# Altium schematic sheet MainBoard_V100_ON_OFF.SchDoc
size A4; SheetNumber: 15; SheetTotal: 22; Title_: On Off Controller
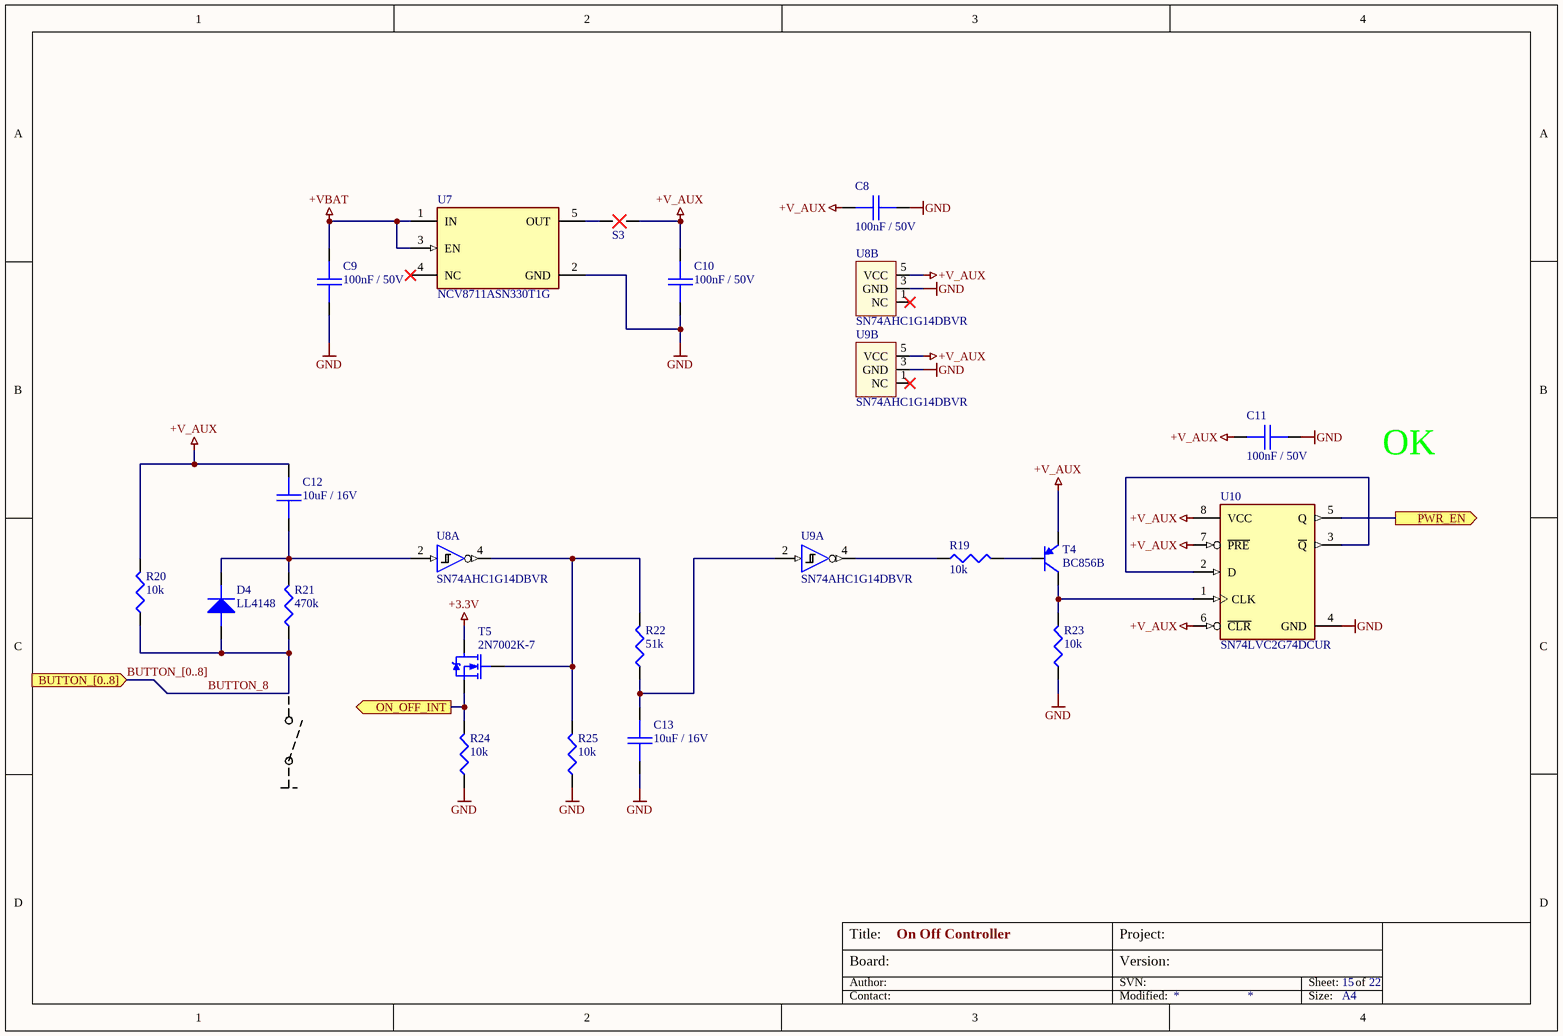
[diagram p0: MainBoard_V100_ON_OFF.SchDoc]

## Parts
C8  100nF / 50V  [0805_C]
C9  100nF / 50V  [0805_C]
C10  100nF / 50V  [0805_C]
C11  100nF / 50V  [0805_C]
C12  10uF / 16V  [0805_C]
C13  10uF / 16V  [0805_C]
D4  LL4148  [SOD80]
R19  10k  [0805]
R20  10k  [0805]
R21  470k  [0805]
R22  51k  [0805]
R23  10k  [0805]
R24  10k  [0805]
R25  10k  [0805]
S3  SPLITER  [SPLITER2_30mil_9mil]  (value not drawn)  (no BOM)
T4  BC856B  [SOT-23]
T5  2N7002K-7  [SOT-23]
U7  NCV8711ASN330T1G  [TSOP-5]
U8  SN74AHC1G14DBVR  [SOT-23-5]  (parts A,B of 2)
U9  SN74AHC1G14DBVR  [SOT-23-5]  (parts A,B of 2)
U10  SN74LVC2G74DCUR  [VSSOP-8_DCU]

## Ports
BUTTON_[0..8] (in), ON_OFF_INT (out), PWR_EN (out)

## Nets
+3.3V: T5.3(D)
+V_AUX: C8.1 C10.2 C11.1 C12.1 R20.2 S3.2 T4.2(E) U8.5(VCC) U9.5(VCC) U10.6(~{CLR}) U10.7(~{PRE}) U10.8(VCC)
+VBAT: C9.2 U7.1(IN) U7.3(EN)
GND: C8.2 C9.1 C10.1 C11.2 C13.2 R23.1 R24.1 R25.1 U7.2(GND) U8.3(GND) U9.3(GND) U10.4(GND)
BUTTON_8: D4.A R20.1 R21.1
ON_OFF_INT: R24.2 T5.2(S) ; port ON_OFF_INT
PWR_EN: U10.5(Q) ; port PWR_EN
NetC12_2: C12.2 D4.K R21.2 U8.2(A)
NetC13_1: C13.1 R22.1 U9.2(A)
NetR19_1: R19.1 U9.4(Y)
NetR19_2: R19.2 T4.1(B)
NetR22_2: R22.2 R25.2 T5.1(G) U8.4(Y)
NetR23_2: R23.2 T4.3(C) U10.1(CLK)
NetS3_1: S3.1 U7.5(OUT)
NetU10_2: U10.2(D) U10.3(~{Q})

Not connected (* = marked no-connect by the designer): U7 4(NC)*; U8 1(NC)*; U9 1(NC)*

## Buses and harness runs
bus BUTTON_[0..8] = port BUTTON_[0..8]

## Notes on the sheet
- OK
- Board:
- Author:
- Title:
- Project:
- SVN:
- Version:
- Sheet:
- of
- Contact:
- Modified:
- Size:
- A4

## Library data of the parts
C8-C11 = 149: 100nF 50V X7R; Part Number: SMD0805-100nF-50V; Azonosító: 149; Category: Passives; Subcategory: PASS_Capacitor; Supplier 1: HESTORE; Supplier 1 order number: 100.011.22
C12 C13 = 153: 10uF 16V X5R; Part Number: SMD0805-10uF-16V; Azonosító: 153; Category: Passives; Subcategory: PASS_Capacitor; Supplier 1: HESTORE; Supplier 1 order number: 100.344.52
D4 = 372: General Purpose, Power, Switching Small Signal Diode, SOD-80, 100V, 0.15A, 175C; Azonosító: 372; Part Number: LL4148; Category: Semiconductors; Subcategory: SEMI_Diode; Supplier 1: MOUSER; Supplier 1 order number: 637-LL4148; Supplier 2: HESTORE; Supplier 2 order number: 100.230.69; Help URL: https://diotec.com/request/datasheet/ll4148.pdf
R19 R20 R23-R25 = 59: 10k 0805 0.125W 1%; Part Number: SMD0805-10k 1%; Azonosító: 59; Category: Passives; Subcategory: PASS_Resistor; Supplier 1: HESTORE; Supplier 1 order number: 100.403.38
R21 = 69: 470k 0805 0.125W 1%; Part Number: SMD0805-470k 1%; Azonosító: 69; Category: Passives; Subcategory: PASS_Resistor; Supplier 1: HESTORE; Supplier 1 order number: 100.011.79
R22 = 64: 51k 0805 0.125W 5%; Part Number: SMD0805-51k 5%; Azonosító: 64; Category: Passives; Subcategory: PASS_Resistor; Supplier 1: HESTORE; Supplier 1 order number: 100.201.72
S3 = 272: SPLITER2_30mil_9mil; Azonosító: 272; Part Number: SPLITER2_30mil_9mil; Category: Accessories; Subcategory: ACCE_Other
T4 = 312: BC856B Bipolar (BJT) Single Transistor, PNP, 65 V, 100 mA, 250 mW, SOT-23, Surface Mount; Azonosító: 312; Part Number: BC856B; Category: Semiconductors; Subcategory: SEMI_Transistor; Supplier 1: HESTORE; Supplier 1 order number: 100.001.06; Supplier 2: MOUSER; Supplier 2 order number: 637-BC856B; Help URL: https://hu.mouser.com/datasheet/2/849/bc856-3324318.pdf
T5 = 315: 2N7002K-7 Power MOSFET, N Channel, 60 V, 300 mA, 2 ohm, SOT-23, Surface Mount; Azonosító: 315; Part Number: 2N7002K-7; Category: Semiconductors; Subcategory: SEMI_FET; Supplier 1: HESTORE; Supplier 1 order number: 100.411.92; Supplier 2: MOUSER; Supplier 2 order number: 621-2N7002K-7; Help URL: https://hu.mouser.com/datasheet/2/115/DIOD_S_A0012992590_1-2543827.pdf
U7 = 390: LDO Regulator, 100 mA, 18 V, 1 uA IQ, with PG 3V3 TSOP5; Azonosító: 390; Part Number: NCV8711ASN330T1G; Category: Integrated Circuits; Subcategory: IC_Power; Supplier 1: MOUSER; Supplier 1 order number: 863-NCV8711ASN330T1G; Help URL: https://hu.mouser.com/datasheet/2/308/1/NCV8711_D-2317577.pdf
U8 U9 = 348: Single Inverting Schmitt-Trigger; Azonosító: 348; Part Number: SN74AHC1G14DBVR; Category: Integrated Circuits; Subcategory: IC_Logic; Supplier 1: MOUSER; Supplier 1 order number: 595-SN74AHC1G14DBVR; Supplier 2: FARNELL; Supplier 2 order number: 3120311; Help URL: https://www.ti.com/general/docs/suppproductinfo.tsp?distId=26&gotoUrl=https://www.ti.com/lit/gpn/sn74ahc1g14
U10 = 349: Flip-Flop, 74LVC74, D, 4.1 ns, 200 MHz, 32 mA, VSSOP; Azonosító: 349; Part Number: SN74LVC2G74DCUR; Category: Integrated Circuits; Subcategory: IC_Logic; Supplier 1: MOUSER; Supplier 1 order number: 595-SN74LVC2G74DCUR; Supplier 2: FARNELL; Supplier 2 order number: 3006409; Help URL: https://www.ti.com/general/docs/suppproductinfo.tsp?distId=26&gotoUrl=https://www.ti.com/lit/gpn/sn74lvc2g74